# Altium schematic sheet MAG.SchDoc
size A4; SheetNumber: 7; SheetTotal: 8
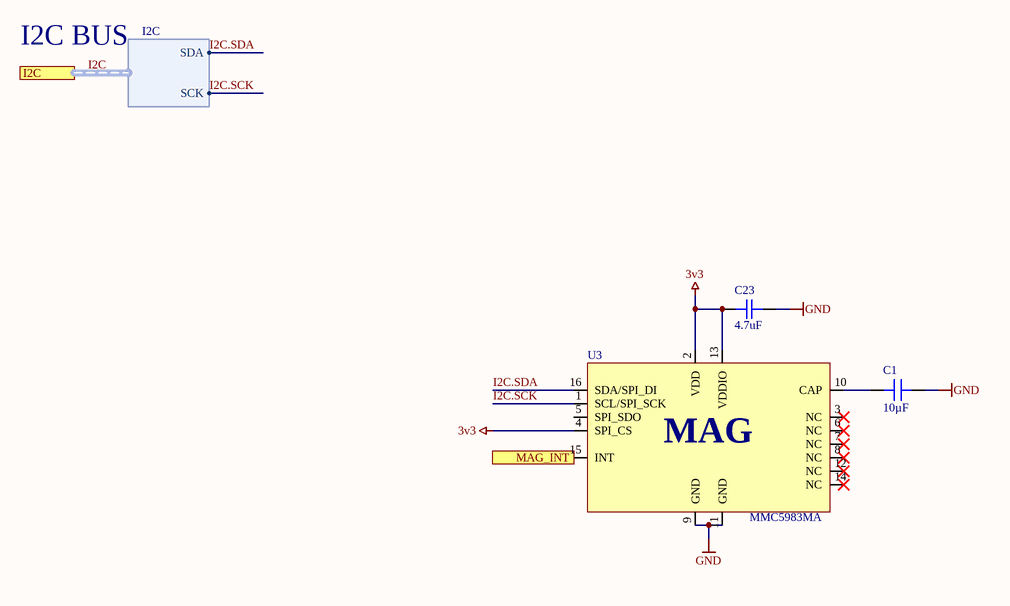
[diagram p0: MAG.SchDoc]

## Parts
C1  value 10µF  [CAP 0603/1608]  (hidden comment: Ceramic_Capacitor)
C23  value 4.7uF  [CAP_0402]  (hidden comment: C0402_10V)
U3  MMC5983MA  [MMC5983MA-LGA]

## Ports
I2C (harness I2C, see Top Level Organization[3B], ESP[1A], IMU[1A]), MAG_INT (out, see Top Level Organization[3C], ESP[3C])

## Harnesses
I2C: SDA, SCK

## Nets
3v3: C23.2 U3.2(VDD) U3.4(SPI_CS) U3.13(VDDIO)
GND: C1.2 C23.1 U3.9(GND) U3.11(GND)
I2C.SCK: U3.1(SCL/SPI_SCK) ; port I2C.SCK
I2C.SDA: U3.16(SDA/SPI_DI) ; port I2C.SDA
MAG_INT: U3.15(INT) ; port MAG_INT
NetC1_1: C1.1 U3.10(CAP)

Not connected (* = marked no-connect by the designer): U3 3(NC)* 5(SPI_SDO) 6(NC)* 7(NC)* 8(NC)* 12(NC)* 14(NC)*

## Buses and harness runs
harness I2C = port I2C

## Notes on the sheet
- I2C BUS
- (in symbol MMC5983MA) MAG

## Library data of the parts
C1 = 0603ZD106MAT2A: CAP CER 10UF 10V X5R 20% 0603; Manufacturer: AVX; Part Name: 0603ZD106MAT2A; Type: Ceramic; Footprint.: 0603; Tolerance: 20%; Temperature Range: -55 ~ 125C; Voltage: 10V; Dielectric: X5R; Manufacturer Part Number: 0603ZD106MAT2A; Component Link: https://www.tme.eu/pl/details/0603zd106mat2a/; Supplier: TME; Supplier Part Number: 0603ZD106MAT2A
C23 = CAP_0402_10V: Capacitor SMD 0402 10V
U3 = MMC5983MA: ±8 Gauss, High Performance 3-axis Magnetic Sensor I2C/SPI; Manufacturer: MEMSIC; Manufacturer Part Number: MMC5983MA